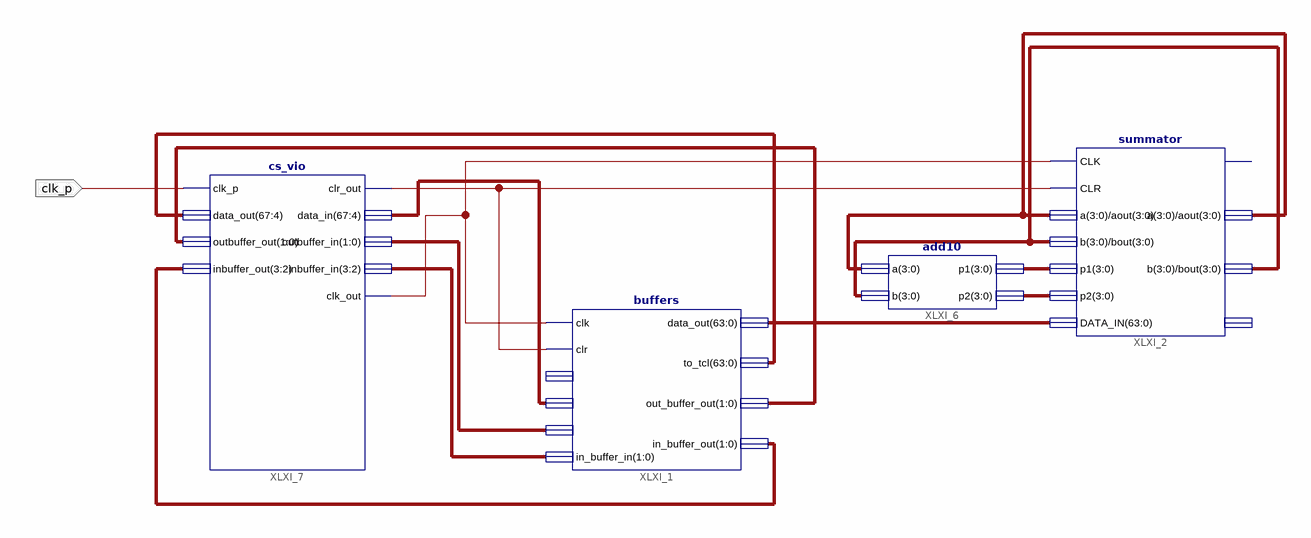
[diagram p0: schematic sheet 1]
// Xilinx ISE schematic top6.sch (spartan6) as structural Verilog: 4 symbols, 1 ports
module top6 (
  input  clk_p
);

  wire XLXN_11, XLXN_13, XLXN_40;
  wire [1:0] XLXN_17, XLXN_20;
  wire [3:0] XLXN_1, XLXN_2, XLXN_27, XLXN_28;
  wire [3:2] XLXN_18, XLXN_21;
  wire [63:0] XLXN_3;
  wire [67:4] XLXN_16, XLXN_19;

  buffers XLXI_1 (
    .clk(XLXN_11), .clr(XLXN_13), .data_in({64{XLXN_40}}), .in_buffer_in(XLXN_18), .data_out(XLXN_3),
    .to_tcl(XLXN_19), .out_buffer_out(XLXN_20), .in_buffer_out(XLXN_21));  // open: from_tcl, out_buffer_in
  summator XLXI_2 (
    .CLK(XLXN_11), .CLR(XLXN_13), .a(XLXN_1), .b(XLXN_2), .p1(XLXN_27), .p2(XLXN_28), .DATA_IN(XLXN_3),
    .aout(XLXN_1), .bout(XLXN_2), .DATA_OUT({64{XLXN_40}}));  // open: CLR_O
  add10 XLXI_6 (.a(XLXN_1), .b(XLXN_2), .p1(XLXN_27), .p2(XLXN_28));
  cs_vio XLXI_7 (
    .clk_p(clk_p), .data_out(XLXN_19), .outbuffer_out(XLXN_20), .inbuffer_out(XLXN_21), .clr_out(XLXN_13),
    .clk_out(XLXN_11), .data_in(XLXN_16), .outbuffer_in(XLXN_17), .inbuffer_in(XLXN_18));
endmodule
